# Altium schematic sheet 01-main.SchDoc: Main
size Letter; DrawnBy: J. Brinton; Engineer: J. Brinton; Revision: 1; SheetNumber: 1; SheetTotal: 14
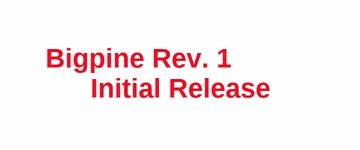
[diagram p0: 01-main.SchDoc]

## Notes on the sheet
- Bigpine Rev. 1
- Initial Release
- Designed By:
- Title
- Engineer
- Revision
- Drawn By
- Date
- Sheet
- of